# EAGLE schematic eagle_dibs_1 (EAGLE 9.5.2)
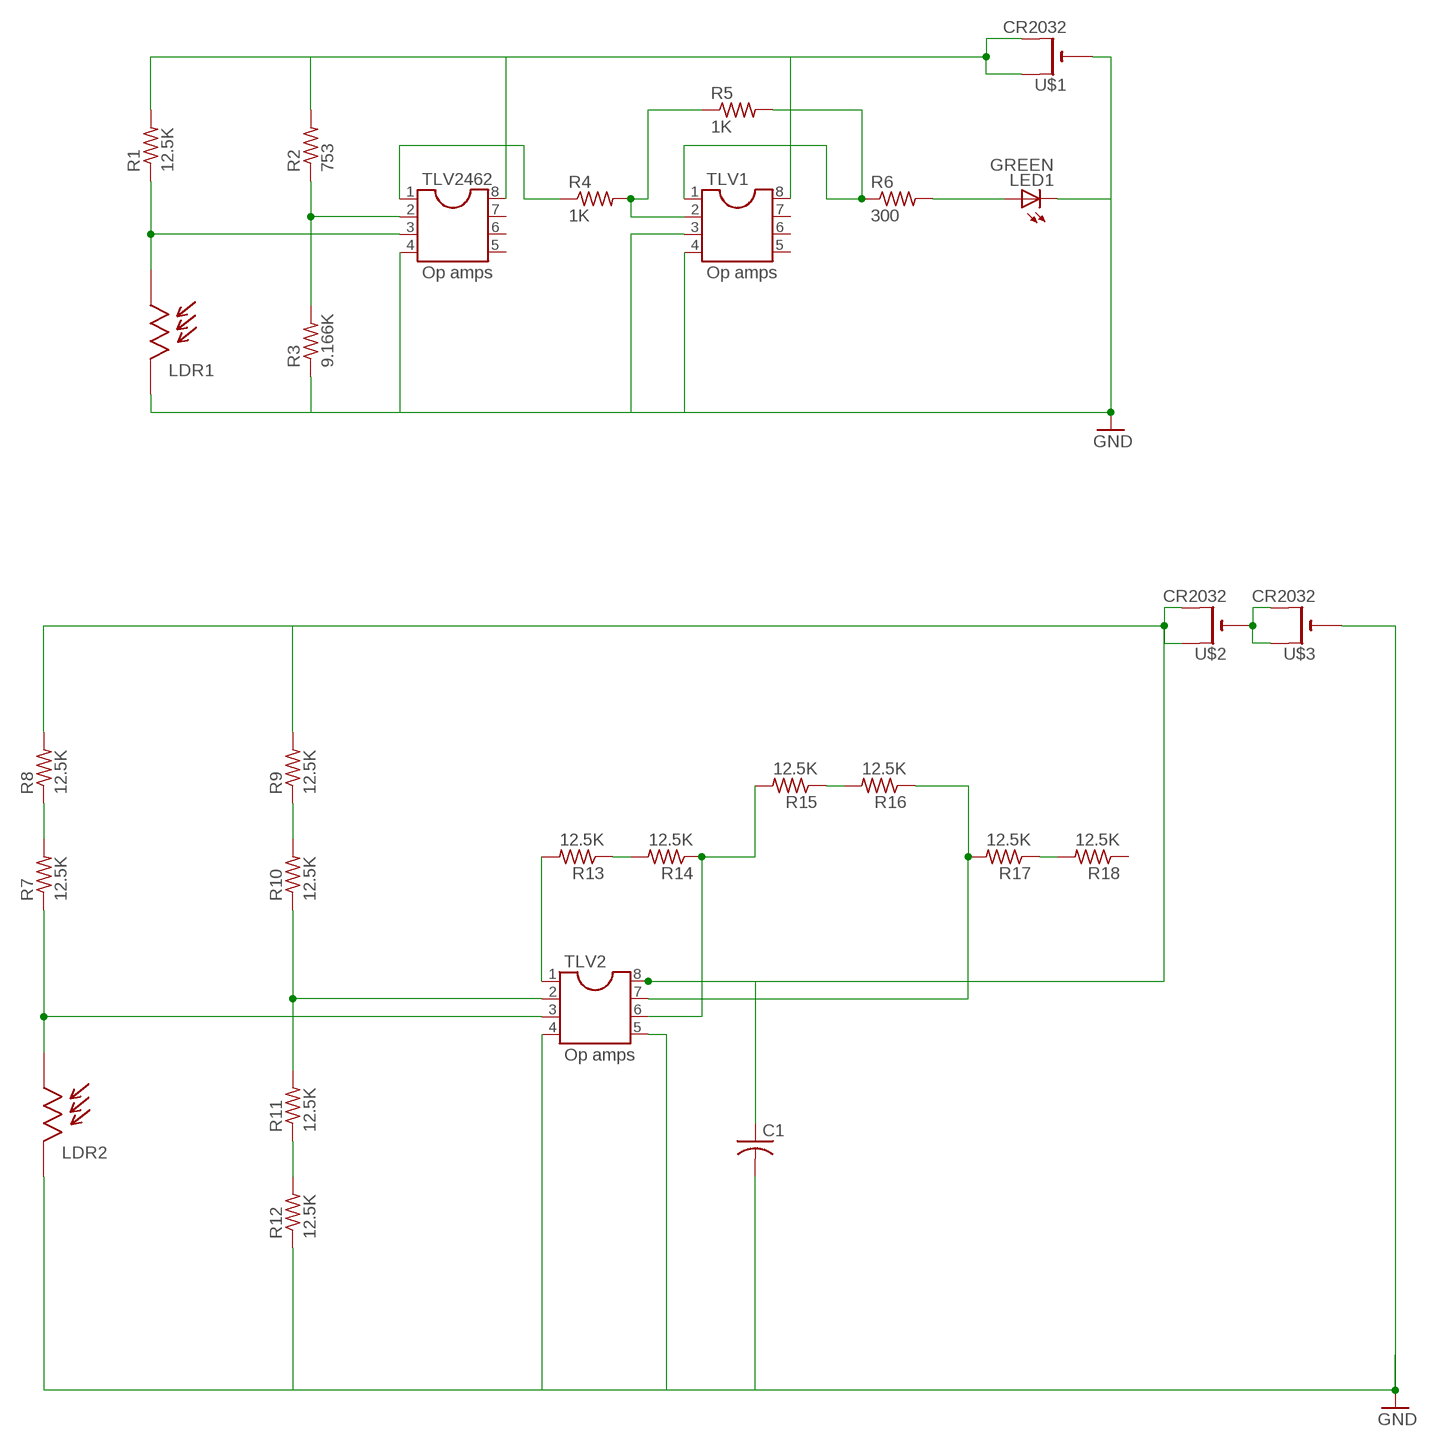
[diagram p0: schematic, sheet 1]

## Parts
C1  C-USC0805  [C0805]
LDR1  On: 555 Off: 855  CDSLDR3MM  [LDR3MM]
LDR2  On: 555 Off: 855  CDSLDR3MM  [LDR3MM]
LED1  GREEN  LED3MM  [LED3MM]
R1  12.5K  R-US_0207/12  [0207/12]
R2  753  R-US_0207/12  [0207/12]
R3  9.166K  R-US_0207/12  [0207/12]
R4  1K  R-US_0207/12  [0207/12]
R5  1K  R-US_0207/12  [0207/12]
R6  300  R-US_0207/12  [0207/12]
R7  12.5K  R-US_0207/12  [0207/12]
R8  12.5K  R-US_0207/12  [0207/12]
R9  12.5K  R-US_0207/12  [0207/12]
R10  12.5K  R-US_0207/12  [0207/12]
R11  12.5K  R-US_0207/12  [0207/12]
R12  12.5K  R-US_0207/12  [0207/12]
R13  12.5K  R-US_0207/12  [0207/12]
R14  12.5K  R-US_0207/12  [0207/12]
R15  12.5K  R-US_0207/12  [0207/12]
R16  12.5K  R-US_0207/12  [0207/12]
R17  12.5K  R-US_0207/12  [0207/12]
R18  12.5K  R-US_0207/12  [0207/12]
TLV1  Op amps  DIL8S  [SOCKET-08]
TLV2  Op amps  DIL8S  [SOCKET-08]
TLV2462  Op amps  DIL8S  [SOCKET-08]
U$1  CR2032  CR2032THM  [CR2032-THRU]
U$2  CR2032  CR2032THM  [CR2032-THRU]
U$3  CR2032  CR2032THM  [CR2032-THRU]

## Nets
GND: C1.2 LDR1.P$2 LDR2.P$2 LED1.K(C) R3.1 R12.1 TLV1.3 TLV1.4 TLV2.4 TLV2.5 TLV2462.4 U$1.- U$3.-
N$1: LDR1.P$1 R1.1 TLV2462.3
N$2: R2.1 R3.2 TLV2462.2
N$3: R1.2 R2.2 TLV1.8 TLV2462.8 U$1.+1(+) U$1.+2(+1)
N$4: LED1.A R6.2
N$5: R5.2 R6.1 TLV1.1
N$6: R4.2 R5.1 TLV1.2
N$7: R4.1 TLV2462.1
N$8: R9.1 R10.2
N$9: R10.1 R11.2 TLV2.2
N$10: R11.1 R12.2
N$11: R7.2 R8.1
N$12: LDR2.P$1 R7.1 TLV2.3
N$16: R13.2 TLV2.1
N$17: R13.1 R14.2
N$18: R14.1 R15.2 TLV2.6
N$20: R15.1 R16.2
N$21: R16.1 R17.2 TLV2.7
N$22: R17.1 R18.2
N$24: C1.1 R8.2 R9.2 TLV2.8 U$2.+1(+) U$2.+2(+1)
N$27: U$2.- U$3.+1(+) U$3.+2(+1)
Unconnected: R18.1 TLV1.5 TLV1.6 TLV1.7 TLV2462.5 TLV2462.6 TLV2462.7

## Library data of the parts
C1 = rcl:C-US: CAPACITOR, American symbol; SPICEPREFIX: C
LDR1 LDR2 = CEDTv40:CDSLDR3MM
LED1 = adafruit:LED: LED OSRAM: - CHIPLED LG R971, LG N971, LY N971, LG Q971, LY Q971, LO R971, LY R971 LH N974, LH R974 LS Q976, LO Q976, LY Q976 LO Q996 - Hyper CHIPLED LW Q18S LB Q993, LB Q99A, LB R99A - SideLED LS A670, LO A670, LY A670, LG A670, LP A670 LB A673, LV A673, LT A673, LW A673 LH A674 LY A675 LS A676, LA A676, LO A676, LY A676, LW A676 LS A679, LY A679, LG A679 - Hyper Micro SIDELED® LS Y876, LA Y876, LO Y876, LY Y876 LT Y87S - SmartLED LW L88C, LW L88S LB L89C, LB L89S, LG L890 LS L89K, LO L89K, LY L89K LS L896, LA L896, LO L896, LY L896 - TOPLED LS T670, LO T670, LY T670, LG T670, LP T670 LSG T670, LSP T670, LSY T670, LOP T670, LYG T670 LG T671, LOG T671, LSG T671 LB T673, LV T673, LT T673, LW T673 LH T674 LS T676, LA T676, LO T676, LY T676, LB T676, LH T676, LSB T676, LW T676 LB T67C, LV T67C, LT T67C, LS T67K, LO T67K, LY T67K, LW E67C LS E67B, LA E67B, LO E67B, LY E67B, LB E67C, LV E67C, LT E67C LW T67C LS T679, LY T679, LG T679 LS T770, LO T770, LY T770, LG T770, LP T770 LB T773, LV T773, LT T773, LW T773 LH T774 LS E675, LA E675, LY E675, LS T675 LS T776, LA T776, LO T776, LY T776, LB T776 LHGB T686 LT T68C, LB T68C - Hyper Mini TOPLED® LB M676 - Mini TOPLED Santana® LG M470 LS M47K, LO M47K, LY M47K Source: http://www.osram.convergy.de/
R1-R18 = rcl:R-US_: RESISTOR, American symbol; SPICEPREFIX: R
TLV1 TLV2 TLV2462 = ic-package:DIL8: Dual In Line / Socket
U$1-U$3 = adafruit:CR2032

## Net classes
0 default: width 0 mm, drill 0 mm
1 vcc: width 0 mm